# Altium project SOCKET_ADAPTER_ENPLAS_OTQ-100-0.5-12.PrjPcb
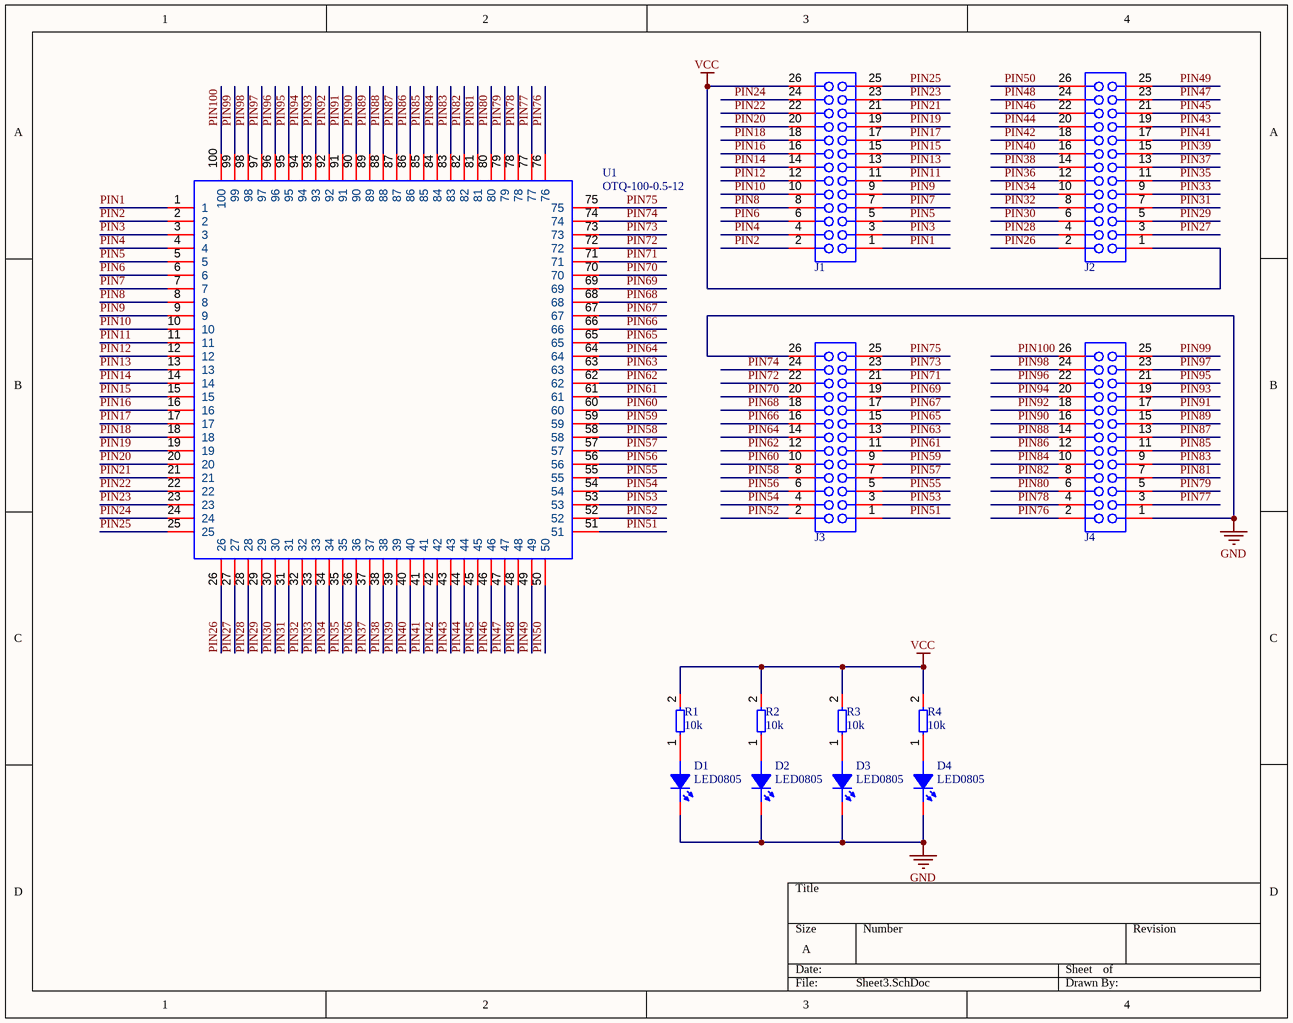
[diagram p0: Sheet3.SchDoc]
1 sheet, 13 parts. Net scope: global (net labels, ports and power ports of the same name join across sheets).
Board file: PCB2.PcbDoc

## Sheet Sheet3.SchDoc
size A

### Parts
D1  LED0805  [L0805RED]
D2  LED0805  [L0805RED]
D3  LED0805  [L0805RED]
D4  LED0805  [L0805RED]
J1  Header 13x2 TH Pitch 2.54mm  [Header 13x2 TH Pitch 2.54mm]  (value not drawn)
J2  Header 13x2 TH Pitch 2.54mm  [Header 13x2 TH Pitch 2.54mm]  (value not drawn)
J3  Header 13x2 TH Pitch 2.54mm  [Header 13x2 TH Pitch 2.54mm]  (value not drawn)
J4  Header 13x2 TH Pitch 2.54mm  [Header 13x2 TH Pitch 2.54mm]  (value not drawn)
R1  10k  [R0805]
R2  10k  [R0805]
R3  10k  [R0805]
R4  10k  [R0805]
U1  OTQ-100-0.5-12  [SOCKET_ENPLAS_OTQ-100-0.5-12]

### Nets
GND: D1.2(K) D2.2(K) D3.2(K) D4.2(K) J3.26 J4.1
VCC: J1.26 J2.1 R1.2 R2.2 R3.2 R4.2
PIN1: J1.1 U1.1
PIN2: J1.2 U1.2
PIN3: J1.3 U1.3
PIN4: J1.4 U1.4
PIN5: J1.5 U1.5
PIN6: J1.6 U1.6
PIN7: J1.7 U1.7
PIN8: J1.8 U1.8
PIN9: J1.9 U1.9
PIN10: J1.10 U1.10
PIN11: J1.11 U1.11
PIN12: J1.12 U1.12
PIN13: J1.13 U1.13
PIN14: J1.14 U1.14
PIN15: J1.15 U1.15
PIN16: J1.16 U1.16
PIN17: J1.17 U1.17
PIN18: J1.18 U1.18
PIN19: J1.19 U1.19
PIN20: J1.20 U1.20
PIN21: J1.21 U1.21
PIN22: J1.22 U1.22
PIN23: J1.23 U1.23
PIN24: J1.24 U1.24
PIN25: J1.25 U1.25
PIN26: J2.2 U1.26
PIN27: J2.3 U1.27
PIN28: J2.4 U1.28
PIN29: J2.5 U1.29
PIN30: J2.6 U1.30
PIN31: J2.7 U1.31
PIN32: J2.8 U1.32
PIN33: J2.9 U1.33
PIN34: J2.10 U1.34
PIN35: J2.11 U1.35
PIN36: J2.12 U1.36
PIN37: J2.13 U1.37
PIN38: J2.14 U1.38
PIN39: J2.15 U1.39
PIN40: J2.16 U1.40
PIN41: J2.17 U1.41
PIN42: J2.18 U1.42
PIN43: J2.19 U1.43
PIN44: J2.20 U1.44
PIN45: J2.21 U1.45
PIN46: J2.22 U1.46
PIN47: J2.23 U1.47
PIN48: J2.24 U1.48
PIN49: J2.25 U1.49
PIN50: J2.26 U1.50
PIN51: J3.1 U1.51
PIN52: J3.2 U1.52
PIN53: J3.3 U1.53
PIN54: J3.4 U1.54
PIN55: J3.5 U1.55
PIN56: J3.6 U1.56
PIN57: J3.7 U1.57
PIN58: J3.8 U1.58
PIN59: J3.9 U1.59
PIN60: J3.10 U1.60
PIN61: J3.11 U1.61
PIN62: J3.12 U1.62
PIN63: J3.13 U1.63
PIN64: J3.14 U1.64
PIN65: J3.15 U1.65
PIN66: J3.16 U1.66
PIN67: J3.17 U1.67
PIN68: J3.18 U1.68
PIN69: J3.19 U1.69
PIN70: J3.20 U1.70
PIN71: J3.21 U1.71
PIN72: J3.22 U1.72
PIN73: J3.23 U1.73
PIN74: J3.24 U1.74
PIN75: J3.25 U1.75
PIN76: J4.2 U1.76
PIN77: J4.3 U1.77
PIN78: J4.4 U1.78
PIN79: J4.5 U1.79
PIN80: J4.6 U1.80
PIN81: J4.7 U1.81
PIN82: J4.8 U1.82
PIN83: J4.9 U1.83
PIN84: J4.10 U1.84
PIN85: J4.11 U1.85
PIN86: J4.12 U1.86
PIN87: J4.13 U1.87
PIN88: J4.14 U1.88
PIN89: J4.15 U1.89
PIN90: J4.16 U1.90
PIN91: J4.17 U1.91
PIN92: J4.18 U1.92
PIN93: J4.19 U1.93
PIN94: J4.20 U1.94
PIN95: J4.21 U1.95
PIN96: J4.22 U1.96
PIN97: J4.23 U1.97
PIN98: J4.24 U1.98
PIN99: J4.25 U1.99
PIN100: J4.26 U1.100
NetD1_1: D1.1(A) R1.1
NetD2_1: D2.1(A) R2.1
NetD3_1: D3.1(A) R3.1
NetD4_1: D4.1(A) R4.1

### Library data of the parts
R1-R4 = Resistor SMD
U1 = SOCKET_ENPLAS_OTQ-100-0.5-12